# Altium project PRUC-Voltmeter.PrjPcb
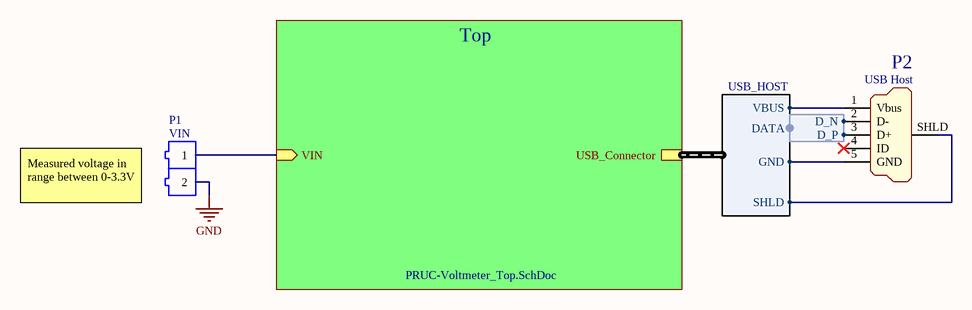
[diagram p0: PRUC-Voltmeter_Connectors.SchDoc]
SchematicsVersion: 1; SchematicsRevision: A; ProjectFullName: PRUC; PCBVersion: 1; PCBRevision: A; PCBAuthor: Piotr Kuligowski; Equipment: Project; CompanyAddress2: AEiI/EiT EB S2/sem.01; CompanyAddress1: PRUC Project; CheckedByName: (not checked); AuthorName: P. Kuligowski / A. Kubicius; ApprovedByName: (nor approved)
9 sheets, 137 parts. Net scope: hierarchical (ports join the sheet entries above them; power ports are global).
Sheets:
  PRUC-Voltmeter_Connectors.SchDoc
    Top = PRUC-Voltmeter_Top.SchDoc
      FPGA Power = PRUC-Voltmeter_FPGA-Power.SchDoc
      Local Supply = PRUC-Voltmeter_Local-Supply.SchDoc
      USB Protection = PRUC-Voltmeter_USB-Protection.SchDoc
      USB-UART Converter = PRUC-Voltmeter_USB-UART-Converter.SchDoc
      FPGA Interface = PRUC-Voltmeter_FPGA-Interface.SchDoc
      FPGA Config = PRUC-Voltmeter_Config.SchDoc
      FPGA Unused = PRUC-Voltmeter_FPGA-Unused.SchDoc

## Sheet PRUC-Voltmeter_Connectors.SchDoc
size A4; SheetNumber: 1; SheetTotal: 9; Time: Voltmeter / Connectors

### Parts
P1  VIN  [DS1021-02G]
P2  USB Host  [USB_Mini-B_Molex_SMT]

### Sub-sheets
Top = PRUC-Voltmeter_Top.SchDoc: USB_Connector (harness USB_HOST), VIN (in)

### Harnesses
USB_HOST: DATA, VBUS, GND, SHLD
USB: D_P, D_N

### Nets
GND: P1.2
HOST_USB_D_N: P2.2(D-) ; harness USB.D_N
HOST_USB_D_P: P2.3(D+) ; harness USB.D_P
HOST_USB_GND: P2.5(GND) ; sheet Top/USB_Connector.GND
HOST_USB_SHLD: P2.SHLD(SHIELD) ; sheet Top/USB_Connector.SHLD
HOST_USB_VBUS: P2.1(Vbus) ; sheet Top/USB_Connector.VBUS
NetP1_1: P1.1 ; sheet Top/VIN

Not connected (* = marked no-connect by the designer): P2 4(ID)*

### Notes on the sheet
- Measured voltage in range between 0-3.3V
- Project:
- Title:
- Variant Name:
- Author:
- Checked by:
- Ver/Rev:
- Date:
- Approved by:
- Sheet:
- of
- File name:

### Library data of the parts
P1 = ZL201-02G: Manufacturer: Connfly; Manufacturer Part Number: DS1021-1*2SF1-1B; Part Description: 2.54mm PIN Header V/T Type. Single Row; Index: 80; Value: 1x2/2.54mm; Part Number: ZL201-02G; SMD: false; Supplier 1: TME; Supplier Part Number 1: ZL201-02G; HelpURL: https://www.tme.eu/Document/cc301e58a5da78cb543a94b5a5b7f06a/DS1021.pdf; Category: Connectors
P2 = 67503-1020: Manufacturer: Molex; Part Description: Connector SMD USB Type Mini-B; Index: 93; Value: USB Mini-B; Part Number: 67503-1020; SMD: true; Manufacturer Part Number: 67503-1020; Supplier 1: TME; Supplier Part Number 1: MX-67503-1020; HelpURL: https://www.tme.eu/Document/0b54384a2825f7831cf676dc2fc979b6/MX-67503-1020.pdf; Category: Connectors

## Sheet PRUC-Voltmeter_Top.SchDoc: Voltmeter / Top
size A4; SheetNumber: 2; SheetTotal: 9
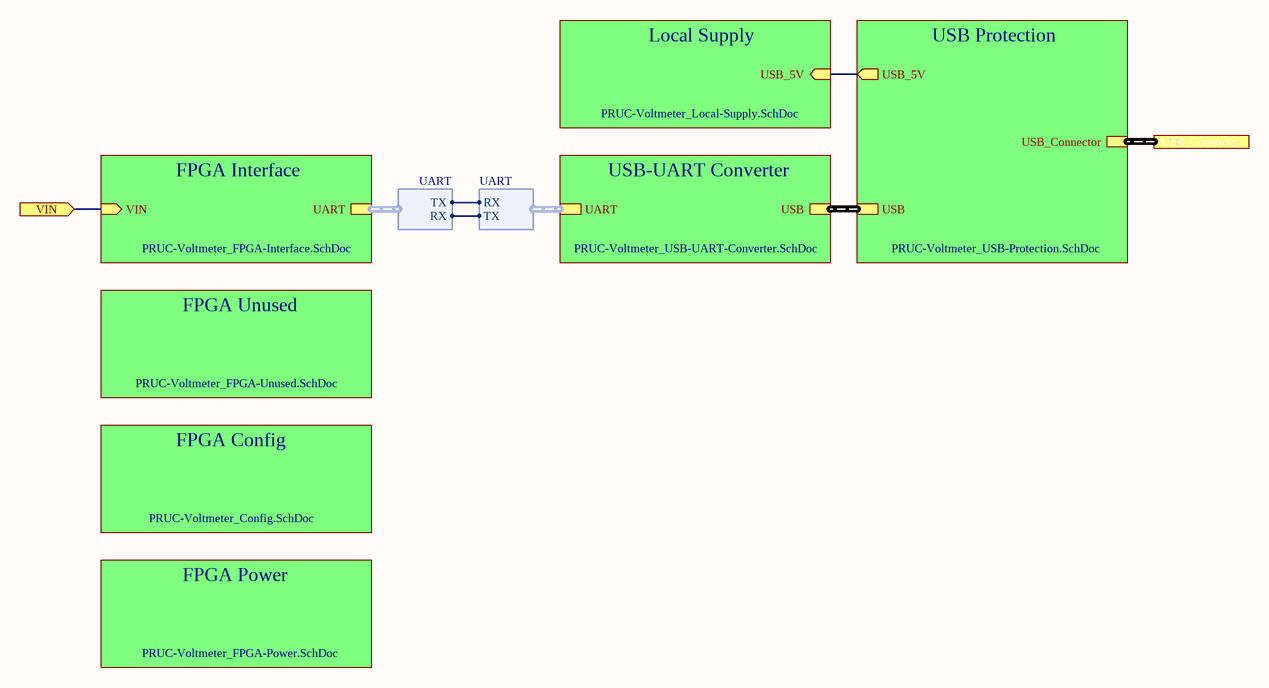
[diagram p1: PRUC-Voltmeter_Top.SchDoc]

### Sub-sheets
FPGA Config = PRUC-Voltmeter_Config.SchDoc: no entries
FPGA Interface = PRUC-Voltmeter_FPGA-Interface.SchDoc: VIN (in), UART (harness UART)
FPGA Power = PRUC-Voltmeter_FPGA-Power.SchDoc: no entries
FPGA Unused = PRUC-Voltmeter_FPGA-Unused.SchDoc: no entries
Local Supply = PRUC-Voltmeter_Local-Supply.SchDoc: USB_5V (in)
USB Protection = PRUC-Voltmeter_USB-Protection.SchDoc: USB_Connector (harness USB_HOST), USB_5V (out), USB (harness USB)
USB-UART Converter = PRUC-Voltmeter_USB-UART-Converter.SchDoc: USB (harness USB), UART (harness UART)

### Ports
USB_Connector (harness USB_HOST), VIN (in)

### Harnesses
UART: TX, RX

### Nets
NetFB3_1: sheet Local Supply/USB_5V, sheet USB Protection/USB_5V
NetP1_1: port VIN, sheet FPGA Interface/VIN
NetU1_J17: sheet USB-UART Converter/UART.TX, sheet FPGA Interface/UART.RX
NetU1_L18: sheet USB-UART Converter/UART.RX, sheet FPGA Interface/UART.TX

### Buses and harness runs
harness port USB_Connector = sheet USB Protection/USB_Connector
harness sheet USB Protection/USB = sheet USB-UART Converter/USB

### Notes on the sheet
- Project:
- Title:
- Variant Name:
- Author:
- Checked by:
- Ver/Rev:
- Date:
- Approved by:
- Sheet:
- of
- File name:

## Sheet PRUC-Voltmeter_FPGA-Power.SchDoc: Voltmeter / FPGA Power
size A4; SheetNumber: 9; SheetTotal: 9
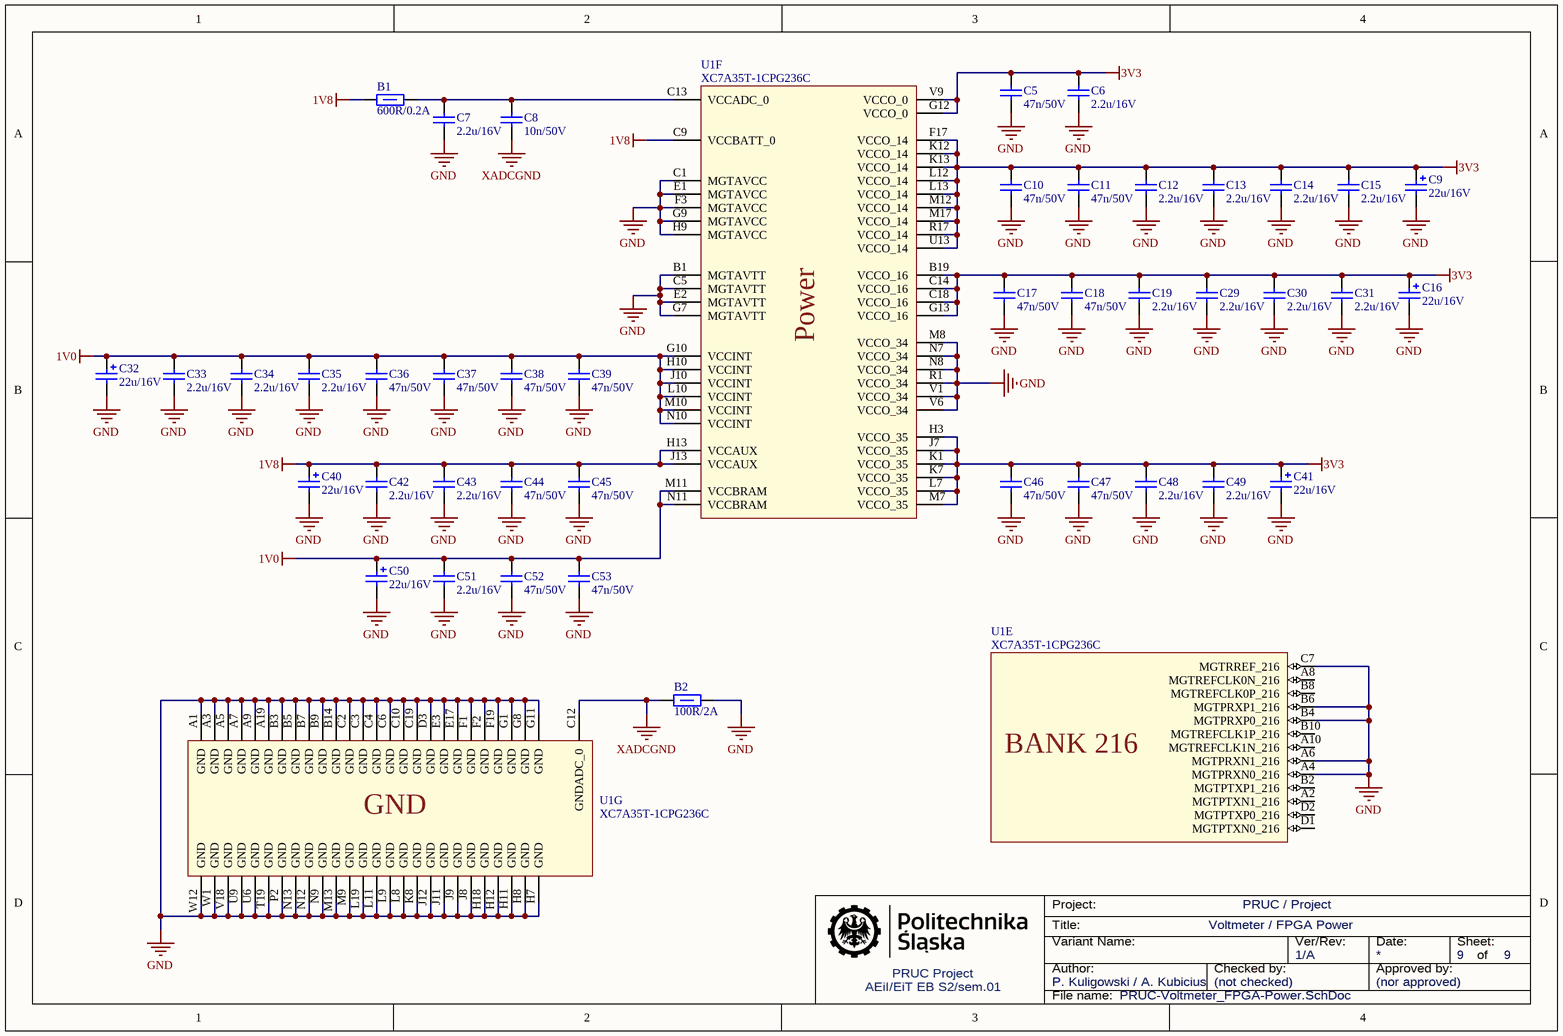
[diagram p2: PRUC-Voltmeter_FPGA-Power.SchDoc]

### Parts
B1  600R/0.2A  [FerriteBead_1206]
B2  100R/2A  [FerriteBead_0603]
C5  47n/50V  [MLCC_0603]
C6  2.2u/16V  [MLCC_0603]
C7  2.2u/16V  [MLCC_0603]
C8  10n/50V  [MLCC_0603]
C9  22u/16V  [Tantalum_B]
C10  47n/50V  [MLCC_0603]
C11  47n/50V  [MLCC_0603]
C12  2.2u/16V  [MLCC_0603]
C13  2.2u/16V  [MLCC_0603]
C14  2.2u/16V  [MLCC_0603]
C15  2.2u/16V  [MLCC_0603]
C16  22u/16V  [Tantalum_B]
C17  47n/50V  [MLCC_0603]
C18  47n/50V  [MLCC_0603]
C19  2.2u/16V  [MLCC_0603]
C29  2.2u/16V  [MLCC_0603]
C30  2.2u/16V  [MLCC_0603]
C31  2.2u/16V  [MLCC_0603]
C32  22u/16V  [Tantalum_B]
C33  2.2u/16V  [MLCC_0603]
C34  2.2u/16V  [MLCC_0603]
C35  2.2u/16V  [MLCC_0603]
C36  47n/50V  [MLCC_0603]
C37  47n/50V  [MLCC_0603]
C38  47n/50V  [MLCC_0603]
C39  47n/50V  [MLCC_0603]
C40  22u/16V  [Tantalum_B]
C41  22u/16V  [Tantalum_B]
C42  2.2u/16V  [MLCC_0603]
C43  2.2u/16V  [MLCC_0603]
C44  47n/50V  [MLCC_0603]
C45  47n/50V  [MLCC_0603]
C46  47n/50V  [MLCC_0603]
C47  47n/50V  [MLCC_0603]
C48  2.2u/16V  [MLCC_0603]
C49  2.2u/16V  [MLCC_0603]
C50  22u/16V  [Tantalum_B]
C51  2.2u/16V  [MLCC_0603]
C52  47n/50V  [MLCC_0603]
C53  47n/50V  [MLCC_0603]
U1  XC7A35T-1CPG236C  [CPG236-0.5mm]  (parts E,F,G of 8)

### Nets
1V0: C32.1 C33.1 C34.1 C35.1 C36.1 C37.1 C38.1 C39.1 C50.1 C51.1 C52.1 C53.1 U1.G10(VCCINT) U1.H10(VCCINT) U1.J10(VCCINT) U1.L10(VCCINT) U1.M10(VCCINT) U1.M11(VCCBRAM) U1.N10(VCCINT) U1.N11(VCCBRAM)
1V8: B1.2 C40.1 C42.1 C43.1 C44.1 C45.1 U1.C9(VCCBATT_0) U1.H13(VCCAUX) U1.J13(VCCAUX)
3V3: C5.1 C6.1 C9.1 C10.1 C11.1 C12.1 C13.1 C14.1 C15.1 C16.1 C17.1 C18.1 C19.1 C29.1 C30.1 C31.1 C41.1 C46.1 C47.1 C48.1 C49.1 U1.B19(VCCO_16) U1.C14(VCCO_16) U1.C18(VCCO_16) U1.F17(VCCO_14) U1.G12(VCCO_0) U1.G13(VCCO_16) U1.H3(VCCO_35) U1.J7(VCCO_35) U1.K1(VCCO_35) U1.K7(VCCO_35) U1.K12(VCCO_14) U1.K13(VCCO_14) U1.L7(VCCO_35) U1.L12(VCCO_14) U1.L13(VCCO_14) U1.M7(VCCO_35) U1.M12(VCCO_14) U1.M17(VCCO_14) U1.R17(VCCO_14) U1.U13(VCCO_14) U1.V9(VCCO_0)
GND: B2.2 C5.2 C6.2 C7.2 C9.2 C10.2 C11.2 C12.2 C13.2 C14.2 C15.2 C16.2 C17.2 C18.2 C19.2 C29.2 C30.2 C31.2 C32.2 C33.2 C34.2 C35.2 C36.2 C37.2 C38.2 C39.2 C40.2 C41.2 C42.2 C43.2 C44.2 C45.2 C46.2 C47.2 C48.2 C49.2 C50.2 C51.2 C52.2 C53.2 U1.A1(GND) U1.A3(GND) U1.A4(MGTPRXN0_216) U1.A5(GND) U1.A6(MGTPRXN1_216) U1.A7(GND) U1.A9(GND) U1.A19(GND) U1.B1(MGTAVTT) U1.B3(GND) U1.B4(MGTPRXP0_216) U1.B5(GND) U1.B6(MGTPRXP1_216) U1.B7(GND) U1.B9(GND) U1.B14(GND) U1.C1(MGTAVCC) U1.C2(GND) U1.C3(GND) U1.C4(GND) U1.C5(MGTAVTT) U1.C6(GND) U1.C7(MGTRREF_216) U1.C10(GND) U1.C19(GND) U1.D3(GND) U1.E1(MGTAVCC) U1.E2(MGTAVTT) U1.E3(GND) U1.E17(GND) U1.F1(GND) U1.F2(GND) U1.F3(MGTAVCC) U1.F19(GND) U1.G1(GND) U1.G7(MGTAVTT) U1.G8(GND) U1.G9(MGTAVCC) U1.G11(GND) U1.H7(GND) U1.H8(GND) U1.H9(MGTAVCC) U1.H11(GND) U1.H12(GND) U1.H18(GND) U1.J8(GND) U1.J9(GND) U1.J11(GND) U1.J12(GND) U1.K8(GND) U1.L8(GND) U1.L9(GND) U1.L11(GND) U1.L19(GND) U1.M8(VCCO_34) U1.M9(GND) U1.M13(GND) U1.N7(VCCO_34) U1.N8(VCCO_34) U1.N9(GND) U1.N12(GND) U1.N13(GND) U1.P2(GND) U1.R1(VCCO_34) U1.T19(GND) U1.U6(GND) U1.U9(GND) U1.V1(VCCO_34) U1.V6(VCCO_34) U1.V18(GND) U1.W1(GND) U1.W12(GND)
XADCGND: B2.1 C8.2 U1.C12(GNDADC_0)
NetB1_1: B1.1 C7.1 C8.1 U1.C13(VCCADC_0)

Not connected (* = marked no-connect by the designer): U1 A2(MGTPTXN1_216) A8(MGTREFCLK0N_216) A10(MGTREFCLK1N_216) B2(MGTPTXP1_216) B8(MGTREFCLK0P_216) B10(MGTREFCLK1P_216) D1(MGTPTXN0_216) D2(MGTPTXP0_216)

### Notes on the sheet
- Project:
- Title:
- Variant Name:
- Author:
- Checked by:
- Ver/Rev:
- Date:
- Approved by:
- Sheet:
- of
- File name:
- (in symbol XC7A35T-1CPG236C, part E) BANK 216
- (in symbol XC7A35T-1CPG236C, part F) Power

### Library data of the parts
B1 = BLM31A601SPT: Manufacturer: Murata; Manufacturer Part Number: BLM31AJ601SN1L; Part Description: Chip EMIFIL Inductor Type Chip Ferrite Beads; Index: 24; Part Number: BLM31A601SPT; Value: 600R/0.2A; SMD: true; Supplier 1: TME; Supplier Part Number 1: BLM31A601SPT; HelpURL: https://www.tme.eu/pl/Document/128ddfe20b0546871ca971b003a1b360/BLM31A260SPT-DTE.pdf; Category: Inductors
B2 = BLM18EG101TN1D: Manufacturer: Murata; Part Description: Chip EMIFIL Inductor Type Chip Ferrite Beads; Index: 30; Part Number: BLM18EG101TN1D; Value: 100R/2A; SMD: true; Manufacturer Part Number: BLM18EG101TN1D; Supplier 1: TME; Supplier Part Number 1: BLM18EG101TN1D; HelpURL: https://www.tme.eu/Document/f75b66d976bcb5ae8e5c98dcdbe6ac82/BLM18EG101TN1%23.pdf; Category: Inductors
C5 C10 C11 C17 C18 C36-C39 C44-C47 C52 C53 = CL10B473KB8NNNC: Manufacturer: Samsung; Part Description: 0603 General Multilayer Ceramic Capacitor; Index: 160; Part Number: CL10B473KB8NNNC; Value: 47n/50V; SMD: true; Manufacturer Part Number: CL10B473KB8NNNC; Supplier 1: TME; Supplier Part Number 1: CL10B473KB8NNNC; HelpURL: https://www.tme.eu/Document/4a42202b32dab16128fe107dd69598cc/samsung-chip-cap.pdf; Category: Capacitors
C6 C7 C12-C15 C19 C29-C31 C33-C35 C42 C43 C48 C49 C51 = CL10A225KO8NNNC: Manufacturer: Samsung; Part Description: 0603 General Multilayer Ceramic Capacitor; Index: 71; Part Number: CL10A225KO8NNNC; Value: 2.2u/16V; SMD: true; Manufacturer Part Number: CL10A225KO8NNNC; Supplier 1: TME; Supplier Part Number 1: CL10A225KO8NNNC; HelpURL: https://www.tme.eu/pl/Document/7da762c1dbaf553c64ad9c40d3603826/mlcc_samsung.pdf; Category: Capacitors
C8 = CL10B103KB8NNNC: Manufacturer: Samsung; Part Description: 0603 General Multilayer Ceramic Capacitor; Index: 29; Part Number: CL10B103KB8NNNC; Value: 10n/50V; SMD: true; Manufacturer Part Number: CL10B103KB8NNNC; Supplier 1: TME; Supplier Part Number 1: CL10B103KB8NNNC; HelpURL: https://www.tme.eu/pl/Document/7da762c1dbaf553c64ad9c40d3603826/mlcc_samsung.pdf; Category: Capacitors
C9 C16 C32 C40 C41 C50 = TAJB226K016R: Manufacturer: AVX; Manufacturer Part Number: TAJB226K016RNJ; Part Description: TAJ Series AVX Solid Tantalum Capacitor; Index: 23; Part Number: TAJB226K016R; Value: 22u/16V; SMD: true; Supplier 1: TME; Supplier Part Number 1: TAJB226K016R; HelpURL: https://www.tme.eu/pl/Document/85f84849ee9dc6997647a15c8c95a9d3/taj.pdf; Category: Capacitors
U1 = XC7A35T-1CPG236C: Manufacturer: Xilinx; Part Description: Xilinx 7 Series FPGA; Index: 159; Value: 33280 Cells; Part Number: XC7A35T-1CPG236C; SMD: true; Manufacturer Part Number: XC7A35T-1CPG236C; Supplier 1: Mouser; Supplier Part Number 1: 217-XC7A35T-1CPG236C; HelpURL: https://pl.mouser.com/datasheet/2/903/ds180_7Series_Overview-1591537.pdf; Category: FPGA

## Sheet PRUC-Voltmeter_Local-Supply.SchDoc: Voltmeter / Local Supply
size A4; SheetNumber: 4; SheetTotal: 9
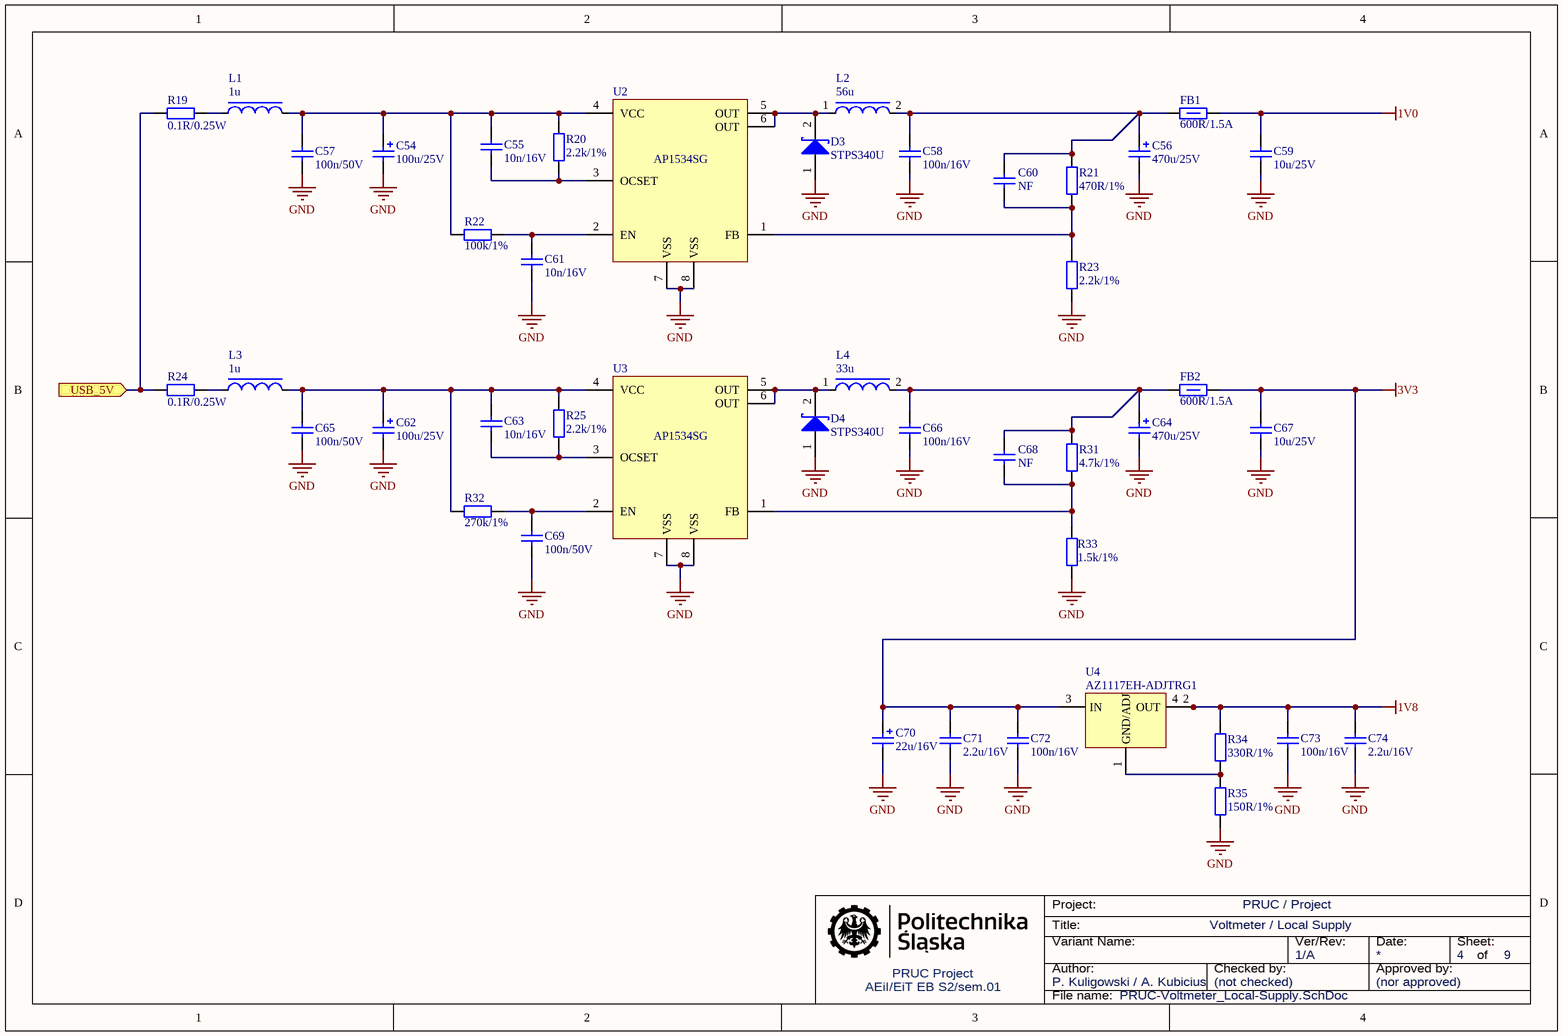
[diagram p3: PRUC-Voltmeter_Local-Supply.SchDoc]

### Parts
C54  100u/25V  [E_Panasonic]
C55  10n/16V  [MLCC_0603]
C56  470u/25V  [G_Panasonic]
C57  100n/50V  [MLCC_0805]
C58  100n/16V  [MLCC_0603]
C59  10u/25V  [MLCC_1206]
C60  NF  [MLCC_0603]
C61  10n/16V  [MLCC_0603]
C62  100u/25V  [E_Panasonic]
C63  10n/16V  [MLCC_0603]
C64  470u/25V  [G_Panasonic]
C65  100n/50V  [MLCC_0805]
C66  100n/16V  [MLCC_0603]
C67  10u/25V  [MLCC_1206]
C68  NF  [MLCC_0603]
C69  100n/50V  [MLCC_0805]
C70  22u/16V  [Tantalum_B]
C71  2.2u/16V  [MLCC_0603]
C72  100n/16V  [MLCC_0603]
C73  100n/16V  [MLCC_0603]
C74  2.2u/16V  [MLCC_0603]
D3  STPS340U  [DO-214AA]
D4  STPS340U  [DO-214AA]
FB1  600R/1.5A  [FerriteBead_1206]
FB2  600R/1.5A  [FerriteBead_1206]
L1  1u  [DER0705]
L2  56u  [DE1207]
L3  1u  [DER0705]
L4  33u  [DE1205]
R19  0.1R/0.25W  [R_1206]
R20  2.2k/1%  [R_0603]
R21  470R/1%  [R_0603]
R22  100k/1%  [R_0603]
R23  2.2k/1%  [R_0603]
R24  0.1R/0.25W  [R_1206]
R25  2.2k/1%  [R_0603]
R31  4.7k/1%  [R_0603]
R32  270k/1%  [R_0603]
R33  1.5k/1%  [R_0603]
R34  330R/1%  [R_0603]
R35  150R/1%  [R_0603]
U2  AP1534SG  [SOIC-8-N]
U3  AP1534SG  [SOIC-8-N]
U4  AZ1117EH-ADJTRG1  [SOT223]

### Ports
USB_5V (in)

### Nets
1V0: C59.1 FB1.1
1V8: C73.1 C74.1 R34.1 U4.2(GND) U4.4(OUT)
3V3: C67.1 C70.1 C71.1 C72.1 FB2.1 U4.3(IN)
GND: C54.2 C56.2 C57.2 C58.2 C59.2 C61.2 C62.2 C64.2 C65.2 C66.2 C67.2 C69.2 C70.2 C71.2 C72.2 C73.2 C74.2 D3.1(A) D4.1(A) R23.2 R33.2 R35.2 U2.7(VSS) U2.8(VSS) U3.7(VSS) U3.8(VSS)
NetC54_1: C54.1 C55.1 C57.1 L1.2 R20.1 R22.1 U2.4(VCC)
NetC55_2: C55.2 R20.2 U2.3(OCSET)
NetC56_1: C56.1 C58.1 C60.1 FB1.2 L2.2 R21.1
NetC60_2: C60.2 R21.2 R23.1 U2.1(FB)
NetC61_1: C61.1 R22.2 U2.2(EN)
NetC62_1: C62.1 C63.1 C65.1 L3.2 R25.1 R32.1 U3.4(VCC)
NetC63_2: C63.2 R25.2 U3.3(OCSET)
NetC64_1: C64.1 C66.1 C68.1 FB2.2 L4.2 R31.1
NetC68_2: C68.2 R31.2 R33.1 U3.1(FB)
NetC69_1: C69.1 R32.2 U3.2(EN)
NetD3_2: D3.2(K) L2.1 U2.5(OUT) U2.6(OUT)
NetD4_2: D4.2(K) L4.1 U3.5(OUT) U3.6(OUT)
NetFB3_1: R19.1 R24.1 ; port USB_5V
NetL1_1: L1.1 R19.2
NetL3_1: L3.1 R24.2
NetR34_2: R34.2 R35.1 U4.1(GND/ADJ)

### Notes on the sheet
- Project:
- Title:
- Variant Name:
- Author:
- Checked by:
- Ver/Rev:
- Date:
- Approved by:
- Sheet:
- of
- File name:

### Library data of the parts
C54 C62 = EEEFK1E101P: Manufacturer: Panasonic; Part Description: Panasonic Aluminum Electrolytic Capacitors; Index: 35; Part Number: EEEFK1E101P; Value: 100u/25V; SMD: true; Manufacturer Part Number: EEEFK1E101P; Supplier 1: TME; Supplier Part Number 1: EEEFK1E101P; HelpURL: https://www.tme.eu/Document/4332e16543451e065f9b478fe48693d2/ABA0000C1181.pdf; Category: Capacitors
C55 C61 C63 = CL10B103KB8NNNC: as C8 on sheet PRUC-Voltmeter_FPGA-Power; Part Number: CL10B103KB8NNNC; Value: 10n/16V; SMD: true; Manufacturer Part Number: CL10B103KB8NNNC; Supplier 1: TME; Supplier Part Number 1: CL10B103KB8NNNC; HelpURL: https://www.tme.eu/pl/Document/7da762c1dbaf553c64ad9c40d3603826/mlcc_samsung.pdf; Category: Capacitors
C56 C64 = EEEFK1E471P: Manufacturer: Panasonic; Part Description: Panasonic Aluminum Electrolytic Capacitors; Index: 34; Part Number: EEEFK1E471P; Value: 470u/25V; SMD: true; Manufacturer Part Number: EEEFK1E471P; Supplier 1: TME; Supplier Part Number 1: EEEFK1E471P; HelpURL: https://www.tme.eu/Document/4332e16543451e065f9b478fe48693d2/ABA0000C1181.pdf; Category: Capacitors
C57 C65 C69 = CL21B104JBCNNNC: Manufacturer: Samsung; Part Description: 0805 General Multilayer Ceramic Capacitor; Index: 36; Part Number: CL21B104JBCNNNC; Value: 100n/50V; SMD: true; Manufacturer Part Number: CL21B104JBCNNNC; Supplier 1: TME; HelpURL: https://www.tme.eu/Document/4a42202b32dab16128fe107dd69598cc/samsung-chip-cap.pdf; Category: Capacitors
C58 C66 C72 C73 = CL10B104KO8NNNC: Manufacturer: Samsung; Part Description: 0603 General Multilayer Ceramic Capacitor; Index: 14; Part Number: CL10B104KO8NNNC; Value: 100n/16V; SMD: true; Manufacturer Part Number: CL10B104KO8NNNC; Supplier 1: TME; Supplier Part Number 1: CL10B104KO8NNNC; HelpURL: https://www.tme.eu/pl/Document/7da762c1dbaf553c64ad9c40d3603826/mlcc_samsung.pdf; Category: Capacitors
C59 C67 = CL31B106KAHNNNE: Manufacturer: Samsung; Part Description: 1206 General Multilayer Ceramic Capacitor; Index: 31; Part Number: CL31B106KAHNNNE; Value: 10u/25V; SMD: true; Manufacturer Part Number: CL31B106KAHNNNE; Supplier 1: TME; Supplier Part Number 1: CL31B106KAHNNNE; HelpURL: https://www.tme.eu/Document/4a42202b32dab16128fe107dd69598cc/samsung-chip-cap.pdf; Category: Capacitors
C60 C68 = CL10C100JB8NNNC: Manufacturer: Samsung; Part Description: 0603 General Multilayer Ceramic Capacitor; Index: 45; Value: 10p/50V; Part Number: CL10C100JB8NNNC; SMD: true; Manufacturer Part Number: CL10C100JB8NNNC; Supplier 1: TME; Supplier Part Number 1: CL10C100JB8NNNC; HelpURL: https://www.tme.eu/Document/7da762c1dbaf553c64ad9c40d3603826/mlcc_samsung.pdf; Category: Capacitors
C70 = TAJB226K016R: as C9 on sheet PRUC-Voltmeter_FPGA-Power; Part Number: TAJB226K016R; Value: 22u/16V; SMD: true; Supplier 1: TME; Supplier Part Number 1: TAJB226K016R; HelpURL: https://www.tme.eu/pl/Document/85f84849ee9dc6997647a15c8c95a9d3/taj.pdf; Category: Capacitors
C71 C74 = CL10A225KO8NNNC: as C6 on sheet PRUC-Voltmeter_FPGA-Power; Part Number: CL10A225KO8NNNC; Value: 2.2u/16V; SMD: true; Manufacturer Part Number: CL10A225KO8NNNC; Supplier 1: TME; Supplier Part Number 1: CL10A225KO8NNNC; HelpURL: https://www.tme.eu/pl/Document/7da762c1dbaf553c64ad9c40d3603826/mlcc_samsung.pdf; Category: Capacitors
D3 D4 = STPS340U: Manufacturer: ST; Part Description: Power Schottky rectifier; Index: 32; Value: 3A/40V; Part Number: STPS340U; SMD: true; Manufacturer Part Number: STPS340U; Supplier 1: TME; Supplier Part Number 1: STPS340U; HelpURL: https://www.tme.eu/Document/027cb527eaf4f789c6b30ace50751cd3/STPS340S.pdf; Category: Diodes
FB1 FB2 = BLM31PG601SN1L: Manufacturer: Murata; Part Description: Chip EMIFIL Inductor Type Chip Ferrite Beads; Index: 37; Part Number: BLM31PG601SN1L; Value: 600R/1.5A; SMD: true; Manufacturer Part Number: BLM31PG601SN1L; Supplier 1: TME; Supplier Part Number 1: BLM31PG601SN1L; HelpURL: https://www.tme.eu/Document/3e4c7afb1640f458e7a0e8f234c05f40/BLM31PG601SN1%23.pdf; Category: Inductors
L1 L3 = DER0705-1: Manufacturer: Ferrocore; Part Description: FERROCORE SMD Power Coil; Index: 39; Value: 1u/2.8A; Part Number: DER0705-1; SMD: true; Manufacturer Part Number: DER0705-1; Supplier 1: TME; Supplier Part Number 1: DER0705-1; HelpURL: https://www.tme.eu/Document/9a80d44ac7714b3daaf4f9db6ecfd32c/der.pdf; Category: Inductors
L2 = DE1207-56: Manufacturer: Ferrocore; Part Description: FERROCORE SMD Power Coil; Index: 122; Value: 56u/2.9A; Part Number: DE1207-56; SMD: true; Manufacturer Part Number: DE1207-56; Supplier 1: TME; Supplier Part Number 1: DE1207-56; HelpURL: https://www.tme.eu/Document/d1f8b47d020ebf11f3b92c6891638dfa/de.pdf; Category: Inductors
L4 = DE1205-33: Manufacturer: Ferrocore; Part Description: FERROCORE SMD Power Coil; Index: 38; Part Number: DE1205-33; Value: 33u; SMD: true; Manufacturer Part Number: DE1205-33; Supplier 1: TME; Supplier Part Number 1: DE1205-33; HelpURL: https://www.tme.eu/Document/d1f8b47d020ebf11f3b92c6891638dfa/de.pdf; Category: Inductors
R19 R24 = 1206S4J010KT5E: Manufacturer: Royalohm; Part Description: Ryalohm Thick Film Chip Resistors; Index: 40; Part Number: 1206S4J010KT5E; Value: 0.1R/0.25W; SMD: true; Manufacturer Part Number: 1206S4J010KT5E; Supplier 1: TME; Supplier Part Number 1: 1206S4J010KT5E; HelpURL: https://www.tme.eu/Document/d5a5e6c4d80848389d3e229cdaf353c1/general.pdf; Category: Resistors
R20 R23 R25 = 0603SAF2201T5E: Manufacturer: Royalohm; Part Description: 0603 Thick Film Chip Resistor; Index: 15; Part Number: 0603SAF2201T5E; Value: 2.2k/1%; SMD: true; Manufacturer Part Number: 0603SAF2201T5E; Supplier 1: TME; HelpURL: https://www.tme.eu/pl/Document/b315665a56acbc42df513c99b390ad98/ROYALOHM-THICKFILM.pdf; Category: Resistors
  R20 R25: Supplier Part Number 1: 0603SAF2201T5E
  R23: Supplier Part Number 1: SMD0603-2K2-1%
R21 = 0603SAF4700T5E: Manufacturer: Royalohm; Part Description: 0603 Thick Film Chip Resistor; Index: 8; Part Number: 0603SAF4700T5E; Value: 470R/1%; SMD: true; Manufacturer Part Number: 0603SAF4700T5E; Supplier 1: TME; Supplier Part Number 1: SMD0603-470R-1%; HelpURL: https://www.tme.eu/pl/Document/b315665a56acbc42df513c99b390ad98/ROYALOHM-THICKFILM.pdf; Category: Resistors
R22 = 0603SAF1003T5E: Manufacturer: Royalohm; Part Description: 0603 Thick Film Chip Resistor; Index: 41; Part Number: 0603SAF1003T5E; Value: 100k/1%; SMD: true; Manufacturer Part Number: 0603SAF1003T5E; Supplier 1: TME; Supplier Part Number 1: 0603SAF1003T5E; HelpURL: https://www.tme.eu/pl/Document/b315665a56acbc42df513c99b390ad98/ROYALOHM-THICKFILM.pdf; Category: Resistors
R31 = 0603SAF4701T5E: Manufacturer: Royalohm; Manufacturer Part Number: SMD0603-4K7-1%; Part Description: 0603 Thick Film Chip Resistor; Index: 44; Part Number: 0603SAF4701T5E; Value: 4.7k/1%; SMD: true; Supplier 1: TME; Supplier Part Number 1: SMD0603-4K7-1%; HelpURL: https://www.tme.eu/Document/b315665a56acbc42df513c99b390ad98/ROYALOHM-THICKFILM.pdf; Category: Resistors
R32 = CRCW0603270KFKTABC: Manufacturer: Vishay; Part Description: Thick Film, Rectangular Commodity Chip Resistors; Index: 55; Part Number: CRCW0603270KFKTABC; Value: 270k/1%; SMD: true; Manufacturer Part Number: CRCW0603270KFKTABC; Supplier 1: TME; Supplier Part Number 1: CRCW0603270KFKTABC; HelpURL: https://www.tme.eu/Document/622e28308c06d160637f2b14751ba16b/Data%20Sheet%20CRCW_BCe3.pdf; Category: Resistors
R33 = 0603SAF1501T5E: Manufacturer: Royalohm; Manufacturer Part Number: SMD0603-1K5-1%; Part Description: 0603 Thick Film Chip Resistor; Index: 42; Part Number: 0603SAF1501T5E; Value: 1.5k/1%; SMD: true; Supplier 1: TME; Supplier Part Number 1: 0603SAF1501T5E; HelpURL: https://www.tme.eu/Document/b315665a56acbc42df513c99b390ad98/ROYALOHM-THICKFILM.pdf; Category: Resistors
R34 = 0603SAF3300T5E: Manufacturer: Royalohm; Part Description: 0603 Thick Film Chip Resistor; Index: 119; Part Number: 0603SAF3300T5E; Value: 330R/1%; SMD: true; Manufacturer Part Number: 0603SAF3300T5E; Supplier 1: TME; Supplier Part Number 1: SMD0603-330R-1%; HelpURL: https://www.tme.eu/pl/Document/b315665a56acbc42df513c99b390ad98/ROYALOHM-THICKFILM.pdf; Category: Resistors
R35 = 0603SAF1500T5E: Manufacturer: Royalohm; Part Description: 0603 Thick Film Chip Resistor; Index: 118; Part Number: 0603SAF1500T5E; Value: 150R/1%; SMD: true; Manufacturer Part Number: 0603SAF1500T5E; Supplier 1: TME; Supplier Part Number 1: SMD0603-150R-1%; HelpURL: https://www.tme.eu/pl/Document/b315665a56acbc42df513c99b390ad98/ROYALOHM-THICKFILM.pdf; Category: Resistors
U2 U3 = AP1534SG: Manufacturer: Diodes Incorporated; Manufacturer Part Number: AP1534SG-13; Part Description: PWM Control 2A Step-Down Converter; Index: 33; Part Number: AP1534SG; SMD: true; Supplier 1: TME; Supplier Part Number 1: AP1534SG-13; HelpURL: https://www.tme.eu/Document/26234f4b23eaef7e527fc422aab04a81/AP1534x-DTE.pdf; Category: DCDC
U4 = AZ1117EH-ADJTRG1: Manufacturer: Diodes Incorporated; Part Description: Micropower Low Dropout Regulator with 1.0A; Index: 113; Value: 1A/15V; Part Number: AZ1117EH-ADJTRG1; SMD: true; Manufacturer Part Number: AZ1117EH-ADJTRG1; Supplier 1: TME; Supplier Part Number 1: AZ1117EH-ADJTRG1; HelpURL: https://www.tme.eu/Document/df7c523beca6764585ffe57dddd107c2/AZ1117E.pdf; Category: Linear Regulators

## Sheet PRUC-Voltmeter_USB-Protection.SchDoc: USB Protection
size A4; SheetNumber: 6; SheetTotal: 9
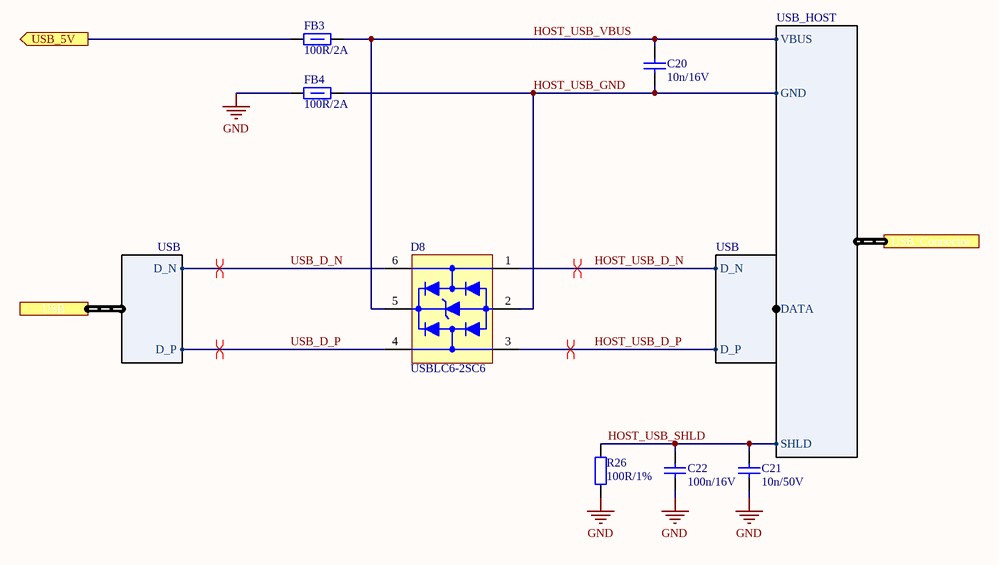
[diagram p4: PRUC-Voltmeter_USB-Protection.SchDoc]

### Parts
C20  10n/16V  [MLCC_0603]
C21  10n/50V  [MLCC_0805]
C22  100n/16V  [MLCC_0603]
D8  USBLC6-2SC6  [SOT23-6]
FB3  100R/2A  [FerriteBead_0603]
FB4  100R/2A  [FerriteBead_0603]
R26  100R/1%  [R_0603]

### Ports
USB (harness USB), USB_5V (out), USB_Connector (harness USB_HOST)

### Harnesses
USB_HOST: DATA, VBUS, GND, SHLD
USB: D_P, D_N

### Nets
GND: C21.2 C22.2 FB4.1 R26.2
HOST_USB_D_N: D8.1(I/O_1) ; harness USB.D_N
HOST_USB_D_P: D8.3(I/O_2) ; harness USB.D_P
HOST_USB_GND: C20.2 D8.2(GND) FB4.2 ; port USB_Connector.GND
HOST_USB_SHLD: C21.1 C22.1 R26.1 ; port USB_Connector.SHLD
HOST_USB_VBUS: C20.1 D8.5(VBUS) FB3.2 ; port USB_Connector.VBUS
USB_D_N: D8.6(I/O_4) ; port USB.D_N
USB_D_P: D8.4(I/O_3) ; port USB.D_P
NetFB3_1: FB3.1 ; port USB_5V

### Layout directives
differential pair: HOST_USB_D_N, HOST_USB_D_P, USB_D_N, USB_D_P

### Notes on the sheet
- Project:
- Title:
- Variant Name:
- Author:
- Checked by:
- Ver/Rev:
- Date:
- Approved by:
- Sheet:
- of
- File name:

### Library data of the parts
C20 = CL10B103KB8NNNC: as C8 on sheet PRUC-Voltmeter_FPGA-Power; Part Number: CL10B103KB8NNNC; Value: 10n/16V; SMD: true; Manufacturer Part Number: CL10B103KB8NNNC; Supplier 1: TME; Supplier Part Number 1: CL10B103KB8NNNC; HelpURL: https://www.tme.eu/pl/Document/7da762c1dbaf553c64ad9c40d3603826/mlcc_samsung.pdf; Category: Capacitors
C21 = CL21B103KBANNNC: Manufacturer: Samsung; Part Description: 0805 General Multilayer Ceramic Capacitor; Index: 9; Part Number: CL21B103KBANNNC; Value: 10n/50V; SMD: true; Manufacturer Part Number: CL21B103KBANNNC; Supplier 1: TME; Supplier Part Number 1: CL21B103KBANNNC; HelpURL: https://www.tme.eu/pl/Document/efa69d9c2b7084c0ec85cad1371d68e3/PESD3V3S2UT.pdf; Category: Capacitors
C22 = CL10B104KO8NNNC: as C58 on sheet PRUC-Voltmeter_Local-Supply; Part Number: CL10B104KO8NNNC; Value: 100n/16V; SMD: true; Manufacturer Part Number: CL10B104KO8NNNC; Supplier 1: TME; Supplier Part Number 1: CL10B104KO8NNNC; HelpURL: https://www.tme.eu/pl/Document/7da762c1dbaf553c64ad9c40d3603826/mlcc_samsung.pdf; Category: Capacitors
D8 = USBLC6-2SC6: Manufacturer: STMicroelectronics; Part Description: Very low capacitance ESD protection; Index: 109; Part Number: USBLC6-2SC6; SMD: true; Manufacturer Part Number: USBLC6-2SC6; Supplier 1: TME; Supplier Part Number 1: USBLC6-2SC6; HelpURL: https://www.tme.eu/Document/db59d28d28a96c34f26d05f234ff409c/USBLC6-2.pdf; Category: Diodes
FB3 FB4 = BLM18EG101TN1D: as B2 on sheet PRUC-Voltmeter_FPGA-Power; Part Number: BLM18EG101TN1D; Value: 100R/2A; SMD: true; Manufacturer Part Number: BLM18EG101TN1D; Supplier 1: TME; Supplier Part Number 1: BLM18EG101TN1D; HelpURL: https://www.tme.eu/Document/f75b66d976bcb5ae8e5c98dcdbe6ac82/BLM18EG101TN1%23.pdf; Category: Inductors
R26 = 0603SAF1000T5E: Manufacturer: Royalohm; Part Description: 0603 Thick Film Chip Resistor; Index: 70; Part Number: 0603SAF1000T5E; Value: 100R/1%; SMD: true; Manufacturer Part Number: 0603SAF1000T5E; Supplier 1: TME; Supplier Part Number 1: SMD0603-100R-1%; HelpURL: https://www.tme.eu/pl/Document/b315665a56acbc42df513c99b390ad98/ROYALOHM-THICKFILM.pdf; Category: Resistors

## Sheet PRUC-Voltmeter_USB-UART-Converter.SchDoc: USB-UART Converter
size A4; SheetNumber: 5; SheetTotal: 9
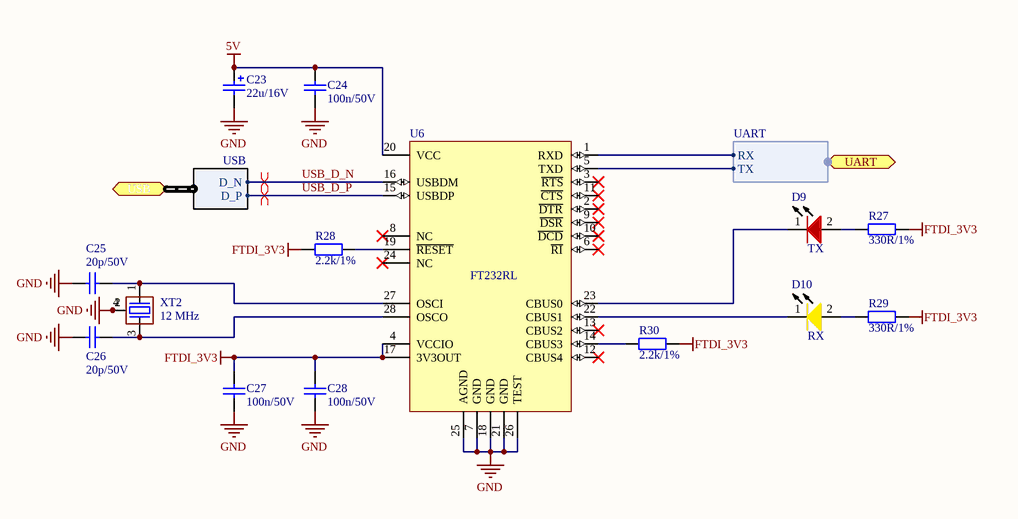
[diagram p5: PRUC-Voltmeter_USB-UART-Converter.SchDoc]

### Parts
C23  22u/16V  [Tantalum_B]
C24  100n/50V  [MLCC_0805]
C25  20p/50V  [MLCC_0603]
C26  20p/50V  [MLCC_0603]
C27  100n/50V  [MLCC_0805]
C28  100n/50V  [MLCC_0805]
D9  TX  [LED_0805_R]
D10  RX  [LED_0805_Y]
R27  330R/1%  [R_0603]
R28  2.2k/1%  [R_0603]
R29  330R/1%  [R_0603]
R30  2.2k/1%  [R_0603]
U6  FT232RL  [TSSOP-28_M]
XT2  12 MHz  [ABM3B]

### Ports
UART (harness UART), USB (harness USB)

### Harnesses
UART: TX, RX
USB: D_P, D_N

### Nets
5V: C23.1 C24.1 U6.20(VCC)
FTDI_3V3: C27.1 C28.1 R27.2 R28.2 R29.2 R30.2 U6.4(VCCIO) U6.17(3V3OUT)
GND: C23.2 C24.2 C25.1 C26.1 C27.2 C28.2 U6.7(GND) U6.18(GND) U6.21(GND) U6.25(AGND) U6.26(TEST) XT2.2(GND) XT2.4(GND)
USB_D_N: U6.16(USBDM) ; port USB.D_N
USB_D_P: U6.15(USBDP) ; port USB.D_P
NetC25_2: C25.2 U6.27(OSCI) XT2.1(inp)
NetC26_2: C26.2 U6.28(OSCO) XT2.3(out)
NetD9_1: D9.1(K) U6.23(CBUS0)
NetD9_2: D9.2(A) R27.1
NetD10_1: D10.1(K) U6.22(CBUS1)
NetD10_2: D10.2(A) R29.1
NetR28_1: R28.1 U6.19(~{RESET})
NetR30_1: R30.1 U6.14(CBUS3)
NetU1_J17: U6.5(TXD) ; port UART.TX
NetU1_L18: U6.1(RXD) ; port UART.RX

Not connected (* = marked no-connect by the designer): U6 2(~{DTR})* 3(~{RTS})* 6(~{RI})* 8(NC)* 9(~{DSR})* 10(~{DCD})* 11(~{CTS})* 12(CBUS4)* 13(CBUS2)* 24(NC)*

### Layout directives
differential pair: USB_D_N, USB_D_P

### Notes on the sheet
- Project:
- Title:
- Variant Name:
- Author:
- Checked by:
- Ver/Rev:
- Date:
- Approved by:
- Sheet:
- of
- File name:

### Library data of the parts
C23 = TAJB226K016R: as C9 on sheet PRUC-Voltmeter_FPGA-Power; Part Number: TAJB226K016R; Value: 22u/16V; SMD: true; Supplier 1: TME; Supplier Part Number 1: TAJB226K016R; HelpURL: https://www.tme.eu/pl/Document/85f84849ee9dc6997647a15c8c95a9d3/taj.pdf; Category: Capacitors
C24 C27 C28 = CL21B104JBCNNNC: as C57 on sheet PRUC-Voltmeter_Local-Supply; Part Number: CL21B104JBCNNNC; Value: 100n/50V; SMD: true; Manufacturer Part Number: CL21B104JBCNNNC; Supplier 1: TME; Supplier Part Number 1: CL21B104JBCNNNC; HelpURL: https://www.tme.eu/Document/4a42202b32dab16128fe107dd69598cc/samsung-chip-cap.pdf; Category: Capacitors
C25 C26 = CL10C200JB8NNNC: Manufacturer: Samsung; Part Description: 0603 General Multilayer Ceramic Capacitor; Index: 57; Part Number: CL10C200JB8NNNC; Value: 20p/50V; SMD: true; Manufacturer Part Number: CL10C200JB8NNNC; Supplier 1: TME; Supplier Part Number 1: CL10C200JB8NNNC; HelpURL: https://www.tme.eu/Document/7da762c1dbaf553c64ad9c40d3603826/mlcc_samsung.pdf; Category: Capacitors
D9 = OSR50805C1E: Manufacturer: OptoSupply; Part Description: 0805 Chip LED Red; Index: 25; Value: Red; Part Number: OSR50805C1E; SMD: true; Manufacturer Part Number: OSR50805C1E; Supplier 1: TME; Supplier Part Number 1: OSR50805C1E; HelpURL: https://www.tme.eu/pl/Document/6f99baddc8b38eb1a865ea6b78250b2b/OSXX0805C1E-DTE.pdf; Category: Diodes
D10 = OSY50805C1E: Manufacturer: OptoSupply; Part Description: 0805 Chip LED Yellow; Index: 27; Value: Yellow; Part Number: OSY50805C1E; SMD: true; Manufacturer Part Number: OSY50805C1E; Supplier 1: TME; Supplier Part Number 1: OSY50805C1E; HelpURL: https://www.tme.eu/pl/Document/6f99baddc8b38eb1a865ea6b78250b2b/OSXX0805C1E-DTE.pdf; Category: Diodes
R27 R29 = 0603SAF3300T5E: as R34 on sheet PRUC-Voltmeter_Local-Supply; Part Number: 0603SAF3300T5E; Value: 330R/1%; SMD: true; Manufacturer Part Number: 0603SAF3300T5E; Supplier 1: TME; Supplier Part Number 1: SMD0603-330R-1%; HelpURL: https://www.tme.eu/pl/Document/b315665a56acbc42df513c99b390ad98/ROYALOHM-THICKFILM.pdf; Category: Resistors
R28 R30 = 0603SAF2201T5E: as R20 on sheet PRUC-Voltmeter_Local-Supply; Part Number: 0603SAF2201T5E; Value: 2.2k/1%; SMD: true; Manufacturer Part Number: 0603SAF2201T5E; Supplier 1: TME; Supplier Part Number 1: 0603SAF2201T5E; HelpURL: https://www.tme.eu/pl/Document/b315665a56acbc42df513c99b390ad98/ROYALOHM-THICKFILM.pdf; Category: Resistors
U6 = FT232RL: Manufacturer: FTDI; Part Description: FTDI USB UART converter; Index: 21; Value: 1ch; Part Number: FT232RL; SMD: true; Manufacturer Part Number: FT232RL; Supplier 1: TME; Supplier Part Number 1: FT232RL; HelpURL: https://www.tme.eu/Document/c3c4deb3631c144a10809782a3ee19f2/FT232RQ.pdf; Category: Interfaces
XT2 = ABM3B-12.000MHZ-B2-T: Manufacturer: ABRACON; Part Description: Ceramic SMD Crystal; Index: 96; Part Number: ABM3B-12.000MHZ-B2-T; Value: 12 MHz; SMD: true; Manufacturer Part Number: ABM3B-12.000MHZ-B2-T; Supplier 1: TME; Supplier Part Number 1: ABM3B-12.000MHZ-B2; HelpURL: https://www.tme.eu/Document/a887f863d547643a986feb1a84bac6c0/abm3b.pdf; Category: Crystal

## Sheet PRUC-Voltmeter_FPGA-Interface.SchDoc: Voltmeter / FPGA XADC
size A4; SheetNumber: 3; SheetTotal: 9
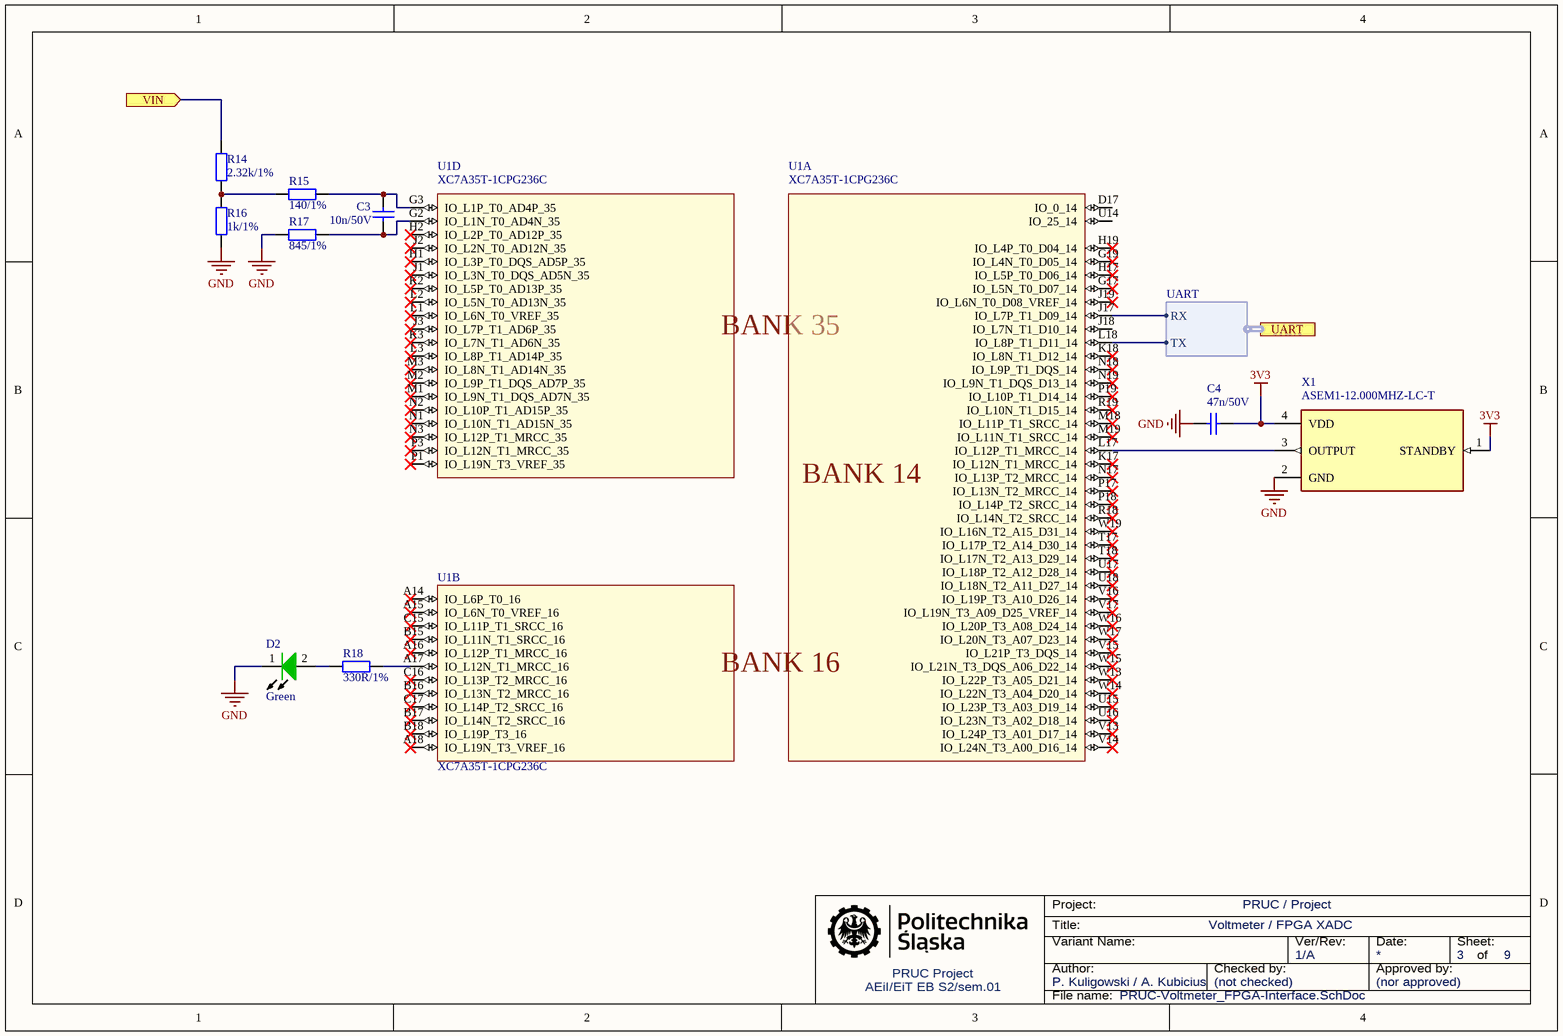
[diagram p6: PRUC-Voltmeter_FPGA-Interface.SchDoc]

### Parts
C3  10n/50V  [MLCC_0603]
C4  47n/50V  [MLCC_0603]
D2  Green  [LED_0805_G]
R14  2.32k/1%  [R_0603]
R15  140/1%  [R_0603]
R16  1k/1%  [R_0603]
R17  845/1%  [R_0603]
R18  330R/1%  [R_0603]
U1  XC7A35T-1CPG236C  [CPG236-0.5mm]  (parts A,B,D of 8)
X1  ASEM1-12.000MHZ-LC-T  [OSC_ASEM1-16.000MHZ-LC-T]

### Ports
UART (harness UART), VIN (in)

### Harnesses
UART: TX, RX

### Nets
3V3: C4.2 X1.1(STANDBY) X1.4(VDD)
GND: C4.1 D2.1(K) R16.2 R17.2 X1.2(GND)
NetC3_1: C3.1 R15.1 U1.G3(IO_L1P_T0_AD4P_35)
NetC3_2: C3.2 R17.1 U1.G2(IO_L1N_T0_AD4N_35)
NetD2_2: D2.2(A) R18.1
NetP1_1: R14.1 ; port VIN
NetR14_2: R14.2 R15.2 R16.1
NetR18_2: R18.2 U1.A17(IO_L12N_T1_MRCC_16)
NetU1_J17: U1.J17(IO_L7P_T1_D09_14) ; port UART.RX
NetU1_L17: U1.L17(IO_L12P_T1_MRCC_14) X1.3(OUTPUT)
NetU1_L18: U1.L18(IO_L8P_T1_D11_14) ; port UART.TX

Not connected (* = marked no-connect by the designer): U1 A14(IO_L6P_T0_16)* A15(IO_L6N_T0_VREF_16)* A16(IO_L12P_T1_MRCC_16)* A18(IO_L19N_T3_VREF_16)* B15(IO_L11N_T1_SRCC_16)* B16(IO_L13N_T2_MRCC_16)* B17(IO_L14N_T2_SRCC_16)* B18(IO_L19P_T3_16)* C15(IO_L11P_T1_SRCC_16)* C16(IO_L13P_T2_MRCC_16)* C17(IO_L14P_T2_SRCC_16)* D17(IO_0_14) G17(IO_L5N_T0_D07_14)* G19(IO_L4N_T0_D05_14)* H1(IO_L3P_T0_DQS_AD5P_35)* H2(IO_L2P_T0_AD12P_35)* H17(IO_L5P_T0_D06_14)* H19(IO_L4P_T0_D04_14)* J1(IO_L3N_T0_DQS_AD5N_35)* J2(IO_L2N_T0_AD12N_35)* J3(IO_L7P_T1_AD6P_35)* J18(IO_L7N_T1_D10_14) J19(IO_L6N_T0_D08_VREF_14)* K2(IO_L5P_T0_AD13P_35)* K3(IO_L7N_T1_AD6N_35)* K17(IO_L12N_T1_MRCC_14)* K18(IO_L8N_T1_D12_14)* L1(IO_L6N_T0_VREF_35)* L2(IO_L5N_T0_AD13N_35)* L3(IO_L8P_T1_AD14P_35)* M1(IO_L9N_T1_DQS_AD7N_35)* M2(IO_L9P_T1_DQS_AD7P_35)* M3(IO_L8N_T1_AD14N_35)* M18(IO_L11P_T1_SRCC_14)* M19(IO_L11N_T1_SRCC_14)* N1(IO_L10N_T1_AD15N_35)* N2(IO_L10P_T1_AD15P_35)* N3(IO_L12P_T1_MRCC_35)* N17(IO_L13P_T2_MRCC_14)* N18(IO_L9P_T1_DQS_14)* N19(IO_L9N_T1_DQS_D13_14)* P1(IO_L19N_T3_VREF_35)* P3(IO_L12N_T1_MRCC_35)* P17(IO_L13N_T2_MRCC_14)* P18(IO_L14P_T2_SRCC_14)* P19(IO_L10P_T1_D14_14)* R18(IO_L14N_T2_SRCC_14)* R19(IO_L10N_T1_D15_14)* T17(IO_L17P_T2_A14_D30_14)* T18(IO_L17N_T2_A13_D29_14)* U14(IO_25_14) U15(IO_L23P_T3_A03_D19_14)* U16(IO_L23N_T3_A02_D18_14)* U17(IO_L18P_T2_A12_D28_14)* U18(IO_L18N_T2_A11_D27_14)* V13(IO_L24P_T3_A01_D17_14)* V14(IO_L24N_T3_A00_D16_14)* V15(IO_L21P_T3_DQS_14)* V16(IO_L19P_T3_A10_D26_14)* V17(IO_L19N_T3_A09_D25_VREF_14)* W13(IO_L22P_T3_A05_D21_14)* W14(IO_L22N_T3_A04_D20_14)* W15(IO_L21N_T3_DQS_A06_D22_14)* W16(IO_L20P_T3_A08_D24_14)* W17(IO_L20N_T3_A07_D23_14)* W19(IO_L16N_T2_A15_D31_14)*

### Notes on the sheet
- Project:
- Title:
- Variant Name:
- Author:
- Checked by:
- Ver/Rev:
- Date:
- Approved by:
- Sheet:
- of
- File name:
- (in symbol XC7A35T-1CPG236C, part A) BANK 14
- (in symbol XC7A35T-1CPG236C, part B) BANK 16
- (in symbol XC7A35T-1CPG236C, part D) BANK 35

### Library data of the parts
C3 = CL10B103KB8NNNC: as C8 on sheet PRUC-Voltmeter_FPGA-Power; Part Number: CL10B103KB8NNNC; Value: 10n/50V; SMD: true; Manufacturer Part Number: CL10B103KB8NNNC; Supplier 1: TME; Supplier Part Number 1: CL10B103KB8NNNC; HelpURL: https://www.tme.eu/pl/Document/7da762c1dbaf553c64ad9c40d3603826/mlcc_samsung.pdf; Category: Capacitors
C4 = CL10B473KB8NNNC: as C5 on sheet PRUC-Voltmeter_FPGA-Power; Part Number: CL10B473KB8NNNC; Value: 47n/50V; SMD: true; Manufacturer Part Number: CL10B473KB8NNNC; Supplier 1: TME; Supplier Part Number 1: CL10B473KB8NNNC; HelpURL: https://www.tme.eu/Document/4a42202b32dab16128fe107dd69598cc/samsung-chip-cap.pdf; Category: Capacitors
D2 = OSG50805C1E: Manufacturer: OptoSupply; Part Description: 0805 Chip LED Green; Index: 26; Part Number: OSG50805C1E; Value: Green; SMD: true; Manufacturer Part Number: OSG50805C1E; Supplier 1: TME; Supplier Part Number 1: OSG50805C1E; HelpURL: https://www.tme.eu/pl/Document/6f99baddc8b38eb1a865ea6b78250b2b/OSXX0805C1E-DTE.pdf; Category: Diodes
R14 R15 R17 = 0603SAF2201T5E: Manufacturer: Royalohm; Part Description: 0603 Thick Film Chip Resistor; Index: 15; Value: 2.2k/1%; Part Number: 0603SAF2201T5E; SMD: true; Manufacturer Part Number: 0603SAF2201T5E; Supplier 1: TME; Supplier Part Number 1: SMD0603-2K2-1%; HelpURL: https://www.tme.eu/pl/Document/b315665a56acbc42df513c99b390ad98/ROYALOHM-THICKFILM.pdf; Category: Resistors
R16 = 0603SAF1001T5E: Manufacturer: Royalohm; Part Description: 0603 Thick Film Chip Resistor; Index: 7; Part Number: 0603SAF1001T5E; Value: 1k/1%; SMD: true; Manufacturer Part Number: 0603SAF1001T5E; Supplier 1: TME; Supplier Part Number 1: SMD0603-1K-1%; HelpURL: https://www.tme.eu/pl/Document/b315665a56acbc42df513c99b390ad98/ROYALOHM-THICKFILM.pdf; Category: Resistors
R18 = 0603SAF3300T5E: as R34 on sheet PRUC-Voltmeter_Local-Supply; Part Number: 0603SAF3300T5E; Value: 330R/1%; SMD: true; Manufacturer Part Number: 0603SAF3300T5E; Supplier 1: TME; Supplier Part Number 1: SMD0603-330R-1%; HelpURL: https://www.tme.eu/pl/Document/b315665a56acbc42df513c99b390ad98/ROYALOHM-THICKFILM.pdf; Category: Resistors
U1 = XC7A35T-1CPG236C: as U1 on sheet PRUC-Voltmeter_FPGA-Power; Part Number: XC7A35T-1CPG236C; SMD: true; Manufacturer Part Number: XC7A35T-1CPG236C; Supplier 1: Mouser; Supplier Part Number 1: 217-XC7A35T-1CPG236C; HelpURL: https://pl.mouser.com/datasheet/2/903/ds180_7Series_Overview-1591537.pdf; Category: FPGA
X1 = ASEM1-16.000MHZ-LC-T: 16MHz XO _Standard_ CMOS Oscillator 3.3V Standby _Power Down_ 4-SMD, No Lead; MF: Abracon LLC; Package: SMD-4 Abracon LLC; Price: None; SnapEDA_Link: https://www.snapeda.com/parts/ASEM1-16.000MHZ-LC-T/Abracon%20LLC/view-part/230242/?ref=snap; Availability: Unavailable; Value: *; MP: ASEM1-16.000MHZ-LC-T

## Sheet PRUC-Voltmeter_Config.SchDoc: Voltmeter / FPGA Config
size A4; SheetNumber: 8; SheetTotal: 9
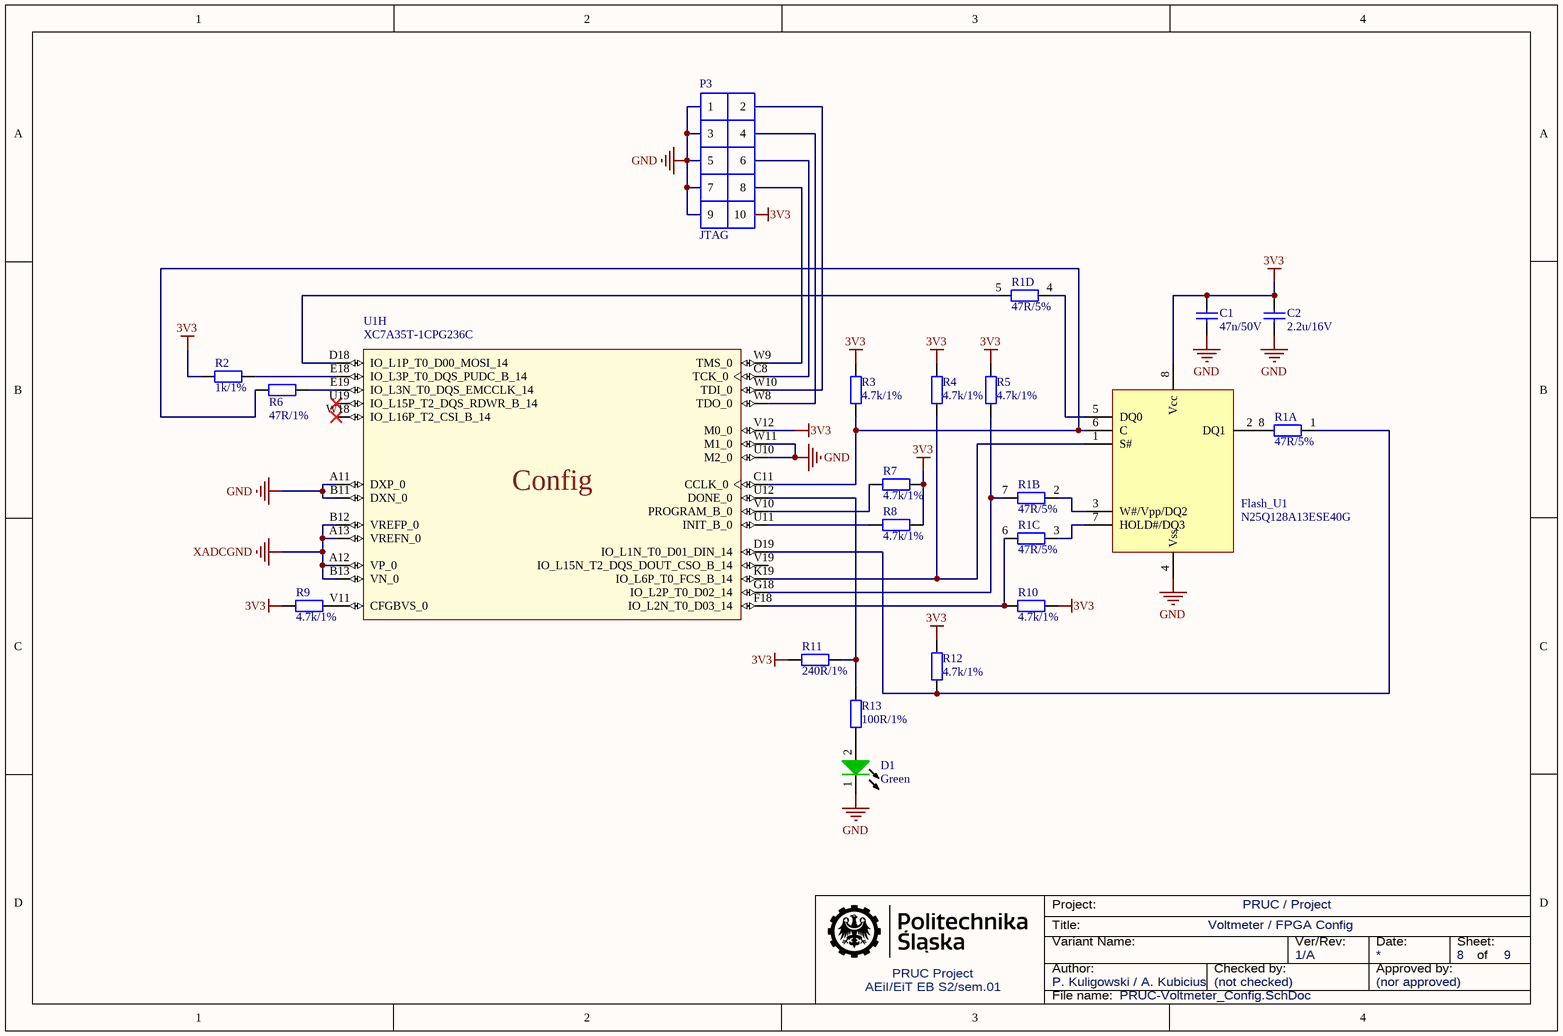
[diagram p7: PRUC-Voltmeter_Config.SchDoc]

### Parts
C1  47n/50V  [MLCC_0603]
C2  2.2u/16V  [MLCC_0603]
D1  Green  [LED_0603_G]
Flash_U1  (no value)  [SOIC-8-W]
P3  JTAG  [DS1021-10G]
R1  47R/5%  [ARRAY_R_0804]  (parts A,B,C,D of 4)
R2  1k/1%  [R_0603]
R3  4.7k/1%  [R_0603]
R4  4.7k/1%  [R_0603]
R5  4.7k/1%  [R_0603]
R6  47R/1%  [R_0603]
R7  4.7k/1%  [R_0603]
R8  4.7k/1%  [R_0603]
R9  4.7k/1%  [R_0603]
R10  4.7k/1%  [R_0603]
R11  240R/1%  [R_0603]
R12  4.7k/1%  [R_0603]
R13  100R/1%  [R_1206]
U1  XC7A35T-1CPG236C  [CPG236-0.5mm]  (part H of 8)

### Nets
3V3: C1.1 C2.1 Flash_U1.8(Vcc) P3.10 R2.1 R3.1 R4.1 R5.2 R7.2 R8.2 R9.1 R10.2 R11.1 R12.1 U1.V12(M0_0)
GND: C1.2 C2.2 D1.1(K) Flash_U1.4(Vss) P3.1 P3.3 P3.5 P3.7 P3.9 U1.A11(DXP_0) U1.B11(DXN_0) U1.U10(M2_0) U1.W11(M1_0)
XADCGND: U1.A12(VP_0) U1.A13(VREFN_0) U1.B12(VREFP_0) U1.B13(VN_0)
NetD1_2: D1.2(A) R13.2
NetFlash_U1_1: Flash_U1.1(S#) R4.2 U1.K19(IO_L6P_T0_FCS_B_14)
NetFlash_U1_2: Flash_U1.2(DQ1) R1.8
NetFlash_U1_3: Flash_U1.3(W#/Vpp/DQ2) R1.2
NetFlash_U1_5: Flash_U1.5(DQ0) R1.4
NetFlash_U1_6: Flash_U1.6(C) R3.2 R6.1 U1.C11(CCLK_0)
NetFlash_U1_7: Flash_U1.7(HOLD#/DQ3) R1.3
NetP3_2: P3.2 U1.W10(TDI_0)
NetP3_4: P3.4 U1.W8(TDO_0)
NetP3_6: P3.6 U1.C8(TCK_0)
NetP3_8: P3.8 U1.W9(TMS_0)
NetR1_1: R1.1 R12.2 U1.D19(IO_L1N_T0_D01_DIN_14)
NetR1_5: R1.5 U1.D18(IO_L1P_T0_D00_MOSI_14)
NetR1_6: R1.6 R10.1 U1.F18(IO_L2N_T0_D03_14)
NetR1_7: R1.7 R5.1 U1.G18(IO_L2P_T0_D02_14)
NetR2_2: R2.2 U1.E18(IO_L3P_T0_DQS_PUDC_B_14)
NetR6_2: R6.2 U1.E19(IO_L3N_T0_DQS_EMCCLK_14)
NetR7_1: R7.1 U1.V10(PROGRAM_B_0)
NetR8_1: R8.1 U1.U11(INIT_B_0)
NetR9_2: R9.2 U1.V11(CFGBVS_0)
NetR11_2: R11.2 R13.1 U1.U12(DONE_0)

Not connected (* = marked no-connect by the designer): U1 U19(IO_L15P_T2_DQS_RDWR_B_14)* V19(IO_L15N_T2_DQS_DOUT_CSO_B_14) W18(IO_L16P_T2_CSI_B_14)*

### Notes on the sheet
- Project:
- Title:
- Variant Name:
- Author:
- Checked by:
- Ver/Rev:
- Date:
- Approved by:
- Sheet:
- of
- File name:
- (in symbol XC7A35T-1CPG236C, part H) Config

### Library data of the parts
C1 = CL10B473KB8NNNC: as C5 on sheet PRUC-Voltmeter_FPGA-Power; Part Number: CL10B473KB8NNNC; Value: 47n/50V; SMD: true; Manufacturer Part Number: CL10B473KB8NNNC; Supplier 1: TME; Supplier Part Number 1: CL10B473KB8NNNC; HelpURL: https://www.tme.eu/Document/4a42202b32dab16128fe107dd69598cc/samsung-chip-cap.pdf; Category: Capacitors
C2 = CL10A225KO8NNNC: as C6 on sheet PRUC-Voltmeter_FPGA-Power; Part Number: CL10A225KO8NNNC; Value: 2.2u/16V; SMD: true; Manufacturer Part Number: CL10A225KO8NNNC; Supplier 1: TME; Supplier Part Number 1: CL10A225KO8NNNC; HelpURL: https://www.tme.eu/pl/Document/7da762c1dbaf553c64ad9c40d3603826/mlcc_samsung.pdf; Category: Capacitors
D1 = KPT-1608MGC: Manufacturer: Kingbright Electronic; Part Description: 0603 Chip LED Green; Index: 133; Part Number: KPT-1608MGC; Value: Green; SMD: true; Manufacturer Part Number: KPT-1608MGC; Supplier 1: TME; Supplier Part Number 1: KPT-1608MGC; HelpURL: https://www.tme.eu/Document/ccb7facb67f7c92dede6afa2fc24e9b1/KPT-1608MGC%28Ver.17B%29.pdf; Category: Diodes
Flash_U1 = N25Q128A13ESE40G: 128Mbit, 3V Serial NOR Flash Memory; Manufacturer: Micron; ManufacturerPartNumber: N25Q128A13ESE40G
P3 = ZL202-10G: Manufacturer: Connfly; Manufacturer Part Number: DS1021-2*5SF11; Part Description: 2.54mm PIN Header V/T Type. Single Row; Index: 82; Value: 2x5/2.54mm; Part Number: ZL202-10G; SMD: false; Supplier 1: TME; Supplier Part Number 1: ZL202-10G; HelpURL: https://www.tme.eu/Document/cc301e58a5da78cb543a94b5a5b7f06a/DS1021.pdf; Category: Connectors
R1 = YC124-JR-0747RL: Manufacturer: Yageo; Part Description: 0804 Array Chip Resistors; Index: 17; Part Number: YC124-JR-0747RL; Value: 47R/5%; SMD: true; Manufacturer Part Number: YC124-JR-0747RL; Supplier 1: TME; Supplier Part Number 1: YC124-JR-0747RL; HelpURL: https://www.tme.eu/pl/Document/d813da3fbd3f246b462e11fb35fa7b68/YC_TC124.pdf; Category: Resistors
R2 = 0603SAF1001T5E: as R16 on sheet PRUC-Voltmeter_FPGA-Interface; Part Number: 0603SAF1001T5E; Value: 1k/1%; SMD: true; Manufacturer Part Number: 0603SAF1001T5E; Supplier 1: TME; Supplier Part Number 1: SMD0603-1K-1%; HelpURL: https://www.tme.eu/pl/Document/b315665a56acbc42df513c99b390ad98/ROYALOHM-THICKFILM.pdf; Category: Resistors
R3-R5 R7-R10 R12 = 0603SAF4701T5E: as R31 on sheet PRUC-Voltmeter_Local-Supply; Part Number: 0603SAF4701T5E; Value: 4.7k/1%; SMD: true; Supplier 1: TME; Supplier Part Number 1: SMD0603-4K7-1%; HelpURL: https://www.tme.eu/Document/b315665a56acbc42df513c99b390ad98/ROYALOHM-THICKFILM.pdf; Category: Resistors
R6 = 0603SAF470JT5E: Manufacturer: Royalohm; Part Description: 0603 Thick Film Chip Resistor; Index: 12; Part Number: 0603SAF470JT5E; Value: 47R/1%; SMD: true; Manufacturer Part Number: 0603SAF470JT5E; Supplier 1: TME; Supplier Part Number 1: SMD0603-47R-1%; HelpURL: https://www.tme.eu/pl/Document/b315665a56acbc42df513c99b390ad98/ROYALOHM-THICKFILM.pdf; Category: Resistors
R11 = 0603SAF0241T5E: Manufacturer: Royalohm; Part Description: 0603 Thick Film Chip Resistor; Index: 10; Part Number: 0603SAF0241T5E; Value: 240R/1%; SMD: true; Manufacturer Part Number: 0603SAF0241T5E; Supplier 1: TME; Supplier Part Number 1: 0603SAF0241T5E; HelpURL: https://www.tme.eu/pl/Document/b315665a56acbc42df513c99b390ad98/ROYALOHM-THICKFILM.pdf; Category: Resistors
R13 = 1206S4F1000T5E: Manufacturer: Royalohm; Part Description: Ryalohm Thick Film Chip Resistors; Index: 75; Part Number: 1206S4F1000T5E; Value: 100R/1%; SMD: true; Manufacturer Part Number: 1206S4F1000T5E; Supplier 1: TME; Supplier Part Number 1: SMD1206-100R-1%; HelpURL: https://www.tme.eu/Document/d5a5e6c4d80848389d3e229cdaf353c1/general.pdf; Category: Resistors
U1 = XC7A35T-1CPG236C: as U1 on sheet PRUC-Voltmeter_FPGA-Power; Part Number: XC7A35T-1CPG236C; SMD: true; Manufacturer Part Number: XC7A35T-1CPG236C; Supplier 1: Mouser; Supplier Part Number 1: 217-XC7A35T-1CPG236C; HelpURL: https://pl.mouser.com/datasheet/2/903/ds180_7Series_Overview-1591537.pdf; Category: FPGA

## Sheet PRUC-Voltmeter_FPGA-Unused.SchDoc: Voltmeter / FPGA Unused
size A4; SheetNumber: 7; SheetTotal: 9
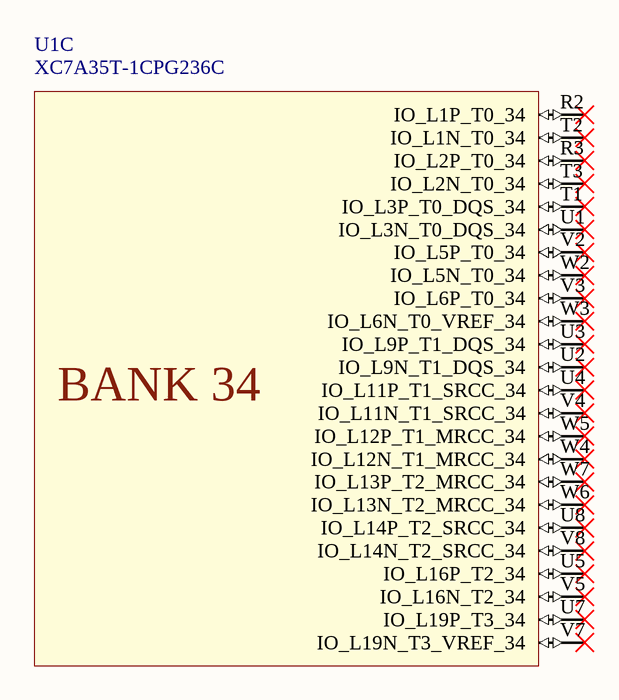
[diagram p8: PRUC-Voltmeter_FPGA-Unused.SchDoc]

### Parts
U1  XC7A35T-1CPG236C  [CPG236-0.5mm]  (part C of 8)

### Nets

Not connected (* = marked no-connect by the designer): U1 R2(IO_L1P_T0_34)* R3(IO_L2P_T0_34)* T1(IO_L3P_T0_DQS_34)* T2(IO_L1N_T0_34)* T3(IO_L2N_T0_34)* U1(IO_L3N_T0_DQS_34)* U2(IO_L9N_T1_DQS_34)* U3(IO_L9P_T1_DQS_34)* U4(IO_L11P_T1_SRCC_34)* U5(IO_L16P_T2_34)* U7(IO_L19P_T3_34)* U8(IO_L14P_T2_SRCC_34)* V2(IO_L5P_T0_34)* V3(IO_L6P_T0_34)* V4(IO_L11N_T1_SRCC_34)* V5(IO_L16N_T2_34)* V7(IO_L19N_T3_VREF_34)* V8(IO_L14N_T2_SRCC_34)* W2(IO_L5N_T0_34)* W3(IO_L6N_T0_VREF_34)* W4(IO_L12N_T1_MRCC_34)* W5(IO_L12P_T1_MRCC_34)* W6(IO_L13N_T2_MRCC_34)* W7(IO_L13P_T2_MRCC_34)*

### Notes on the sheet
- Project:
- Title:
- Variant Name:
- Author:
- Checked by:
- Ver/Rev:
- Date:
- Approved by:
- Sheet:
- of
- File name:
- (in symbol XC7A35T-1CPG236C, part C) BANK 34

### Library data of the parts
U1 = XC7A35T-1CPG236C: as U1 on sheet PRUC-Voltmeter_FPGA-Power; Part Number: XC7A35T-1CPG236C; SMD: true; Manufacturer Part Number: XC7A35T-1CPG236C; Supplier 1: Mouser; Supplier Part Number 1: 217-XC7A35T-1CPG236C; HelpURL: https://pl.mouser.com/datasheet/2/903/ds180_7Series_Overview-1591537.pdf; Category: FPGA

## Nets that join several sheets
1V0: PRUC-Voltmeter_FPGA-Power (20 pins), PRUC-Voltmeter_Local-Supply (C59.1 FB1.1)
1V8: PRUC-Voltmeter_FPGA-Power (9 pins), PRUC-Voltmeter_Local-Supply (5 pins)
3V3: PRUC-Voltmeter_FPGA-Power (42 pins), PRUC-Voltmeter_Local-Supply (6 pins), PRUC-Voltmeter_FPGA-Interface (C4.2 X1.1 X1.4), PRUC-Voltmeter_Config (15 pins)
GND: PRUC-Voltmeter_Connectors (P1.2), PRUC-Voltmeter_FPGA-Power (112 pins), PRUC-Voltmeter_Local-Supply (26 pins), PRUC-Voltmeter_USB-Protection (C21.2 C22.2 FB4.1 R26.2), PRUC-Voltmeter_USB-UART-Converter (13 pins), PRUC-Voltmeter_FPGA-Interface (5 pins), PRUC-Voltmeter_Config (13 pins)
XADCGND: PRUC-Voltmeter_FPGA-Power (B2.1 C8.2 U1.C12), PRUC-Voltmeter_Config (U1.A12 U1.A13 U1.B12 U1.B13)
HOST_USB_D_N: PRUC-Voltmeter_Connectors (P2.2), PRUC-Voltmeter_USB-Protection (D8.1)
HOST_USB_D_P: PRUC-Voltmeter_Connectors (P2.3), PRUC-Voltmeter_USB-Protection (D8.3)
HOST_USB_GND: PRUC-Voltmeter_Connectors (P2.5), PRUC-Voltmeter_USB-Protection (C20.2 D8.2 FB4.2)
HOST_USB_SHLD: PRUC-Voltmeter_Connectors (P2.SHLD), PRUC-Voltmeter_USB-Protection (C21.1 C22.1 R26.1)
HOST_USB_VBUS: PRUC-Voltmeter_Connectors (P2.1), PRUC-Voltmeter_USB-Protection (C20.1 D8.5 FB3.2)
NetFB3_1: PRUC-Voltmeter_Local-Supply (R19.1 R24.1), PRUC-Voltmeter_USB-Protection (FB3.1)
NetP1_1: PRUC-Voltmeter_Connectors (P1.1), PRUC-Voltmeter_FPGA-Interface (R14.1)
NetU1_J17: PRUC-Voltmeter_USB-UART-Converter (U6.5), PRUC-Voltmeter_FPGA-Interface (U1.J17)
NetU1_L18: PRUC-Voltmeter_USB-UART-Converter (U6.1), PRUC-Voltmeter_FPGA-Interface (U1.L18)
USB_D_N: PRUC-Voltmeter_USB-Protection (D8.6), PRUC-Voltmeter_USB-UART-Converter (U6.16)
USB_D_P: PRUC-Voltmeter_USB-Protection (D8.4), PRUC-Voltmeter_USB-UART-Converter (U6.15)